# EAGLE design INSIDER01 (EAGLE 5.02)
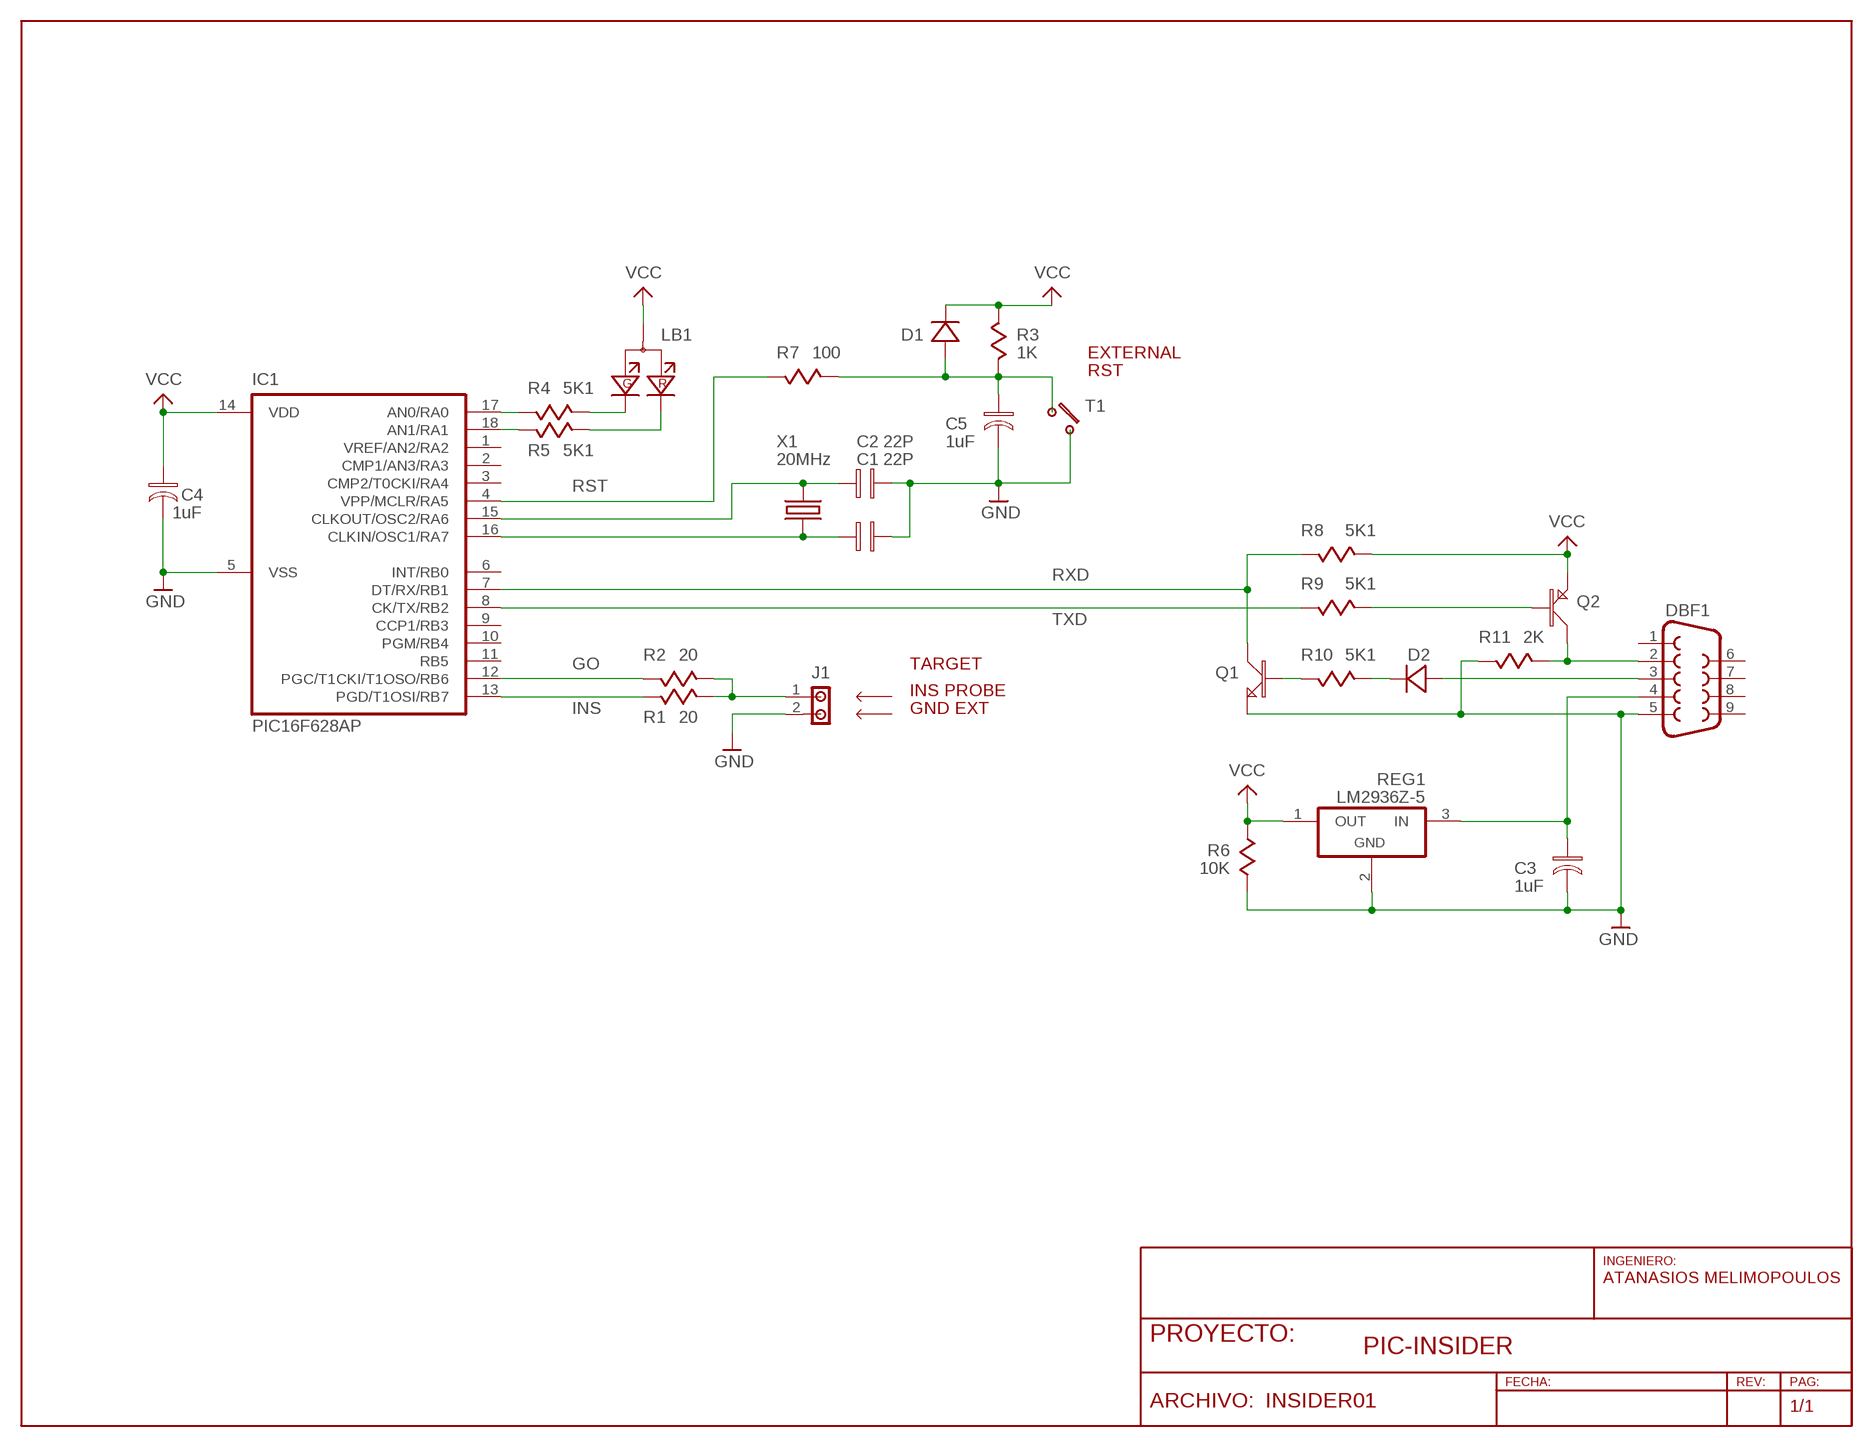
[diagram p0: schematic, sheet 1]

## Parts
C1  22P  CAP02  [C02]
C2  22P  CAP02  [C02]
C3  1uF  CAPE01  [CP01]
C4  1uF  CAPE01  [CP01]
C5  1uF  CAPE01  [CP01]
D1  1N4148  DIODE03  [D03]
D2  1N4148  DIODE03  [D03]
DBF1  F09D  [F09D]
IC1  PIC16F628AP  [DIL18]
J1  JMP2  [JP2]
LB1  LEDBIAC  [LEDBAC]
Q1  NPN1EBC  [TO92A]
Q2  PNP1EBC  [TO92A]
R1  20  RES03A  [R03A]
R2  20  RES03A  [R03A]
R3  1K  RES03A  [R03A]
R4  5K1  RES03A  [R03A]
R5  5K1  RES03A  [R03A]
R6  10K  RES03A  [R03A]
R7  100  RES03A  [R03A]
R8  5K1  RES03A  [R03A]
R9  5K1  RES03A  [R03A]
R10  5K1  RES03A  [R03A]
R11  2K  RES03A  [R03A]
REG1  LM2936Z-5  78XXL  [TO92A]
T1  TEC3  [TEC3L]
X1  20MHz  XTALV300  [HC49V]

## Nets
GND: C1.P$2 C2.P$2 C3.P$2 C4.P$2 C5.P$2 DBF1.5 IC1.5(VSS) J1.2 Q1.1(E) R6.P$2 R11.P$1 REG1.2(GND) T1.1
GO: IC1.12(PGC/T1CKI/T1OSO/RB6) R2.P$2
INS: IC1.13(PGD/T1OSI/RB7) R1.P$1
N$2: D2.P$1(A) DBF1.3
N$3: D2.P$2(K) R10.P$1
N$4: Q1.2(B) R10.P$2
N$8: Q2.2(B) R9.P$2
N$9: J1.1 R1.P$2 R2.P$1
N$10: C2.P$1 IC1.15(CLKOUT/OSC2/RA6) X1.1
N$11: C1.P$1 IC1.16(CLKIN/OSC1/RA7) X1.2
N$12: IC1.17(AN0/RA0) R4.P$2
N$13: C5.P$1 D1.P$1(A) R3.P$2 R7.P$1 T1.4
N$14: LB1.G(K2) R4.P$1
N$15: LB1.R(K1) R5.P$1
N$16: IC1.18(AN1/RA1) R5.P$2
N$19: DBF1.2 Q2.3(C) R11.P$2
N$20: C3.P$1 DBF1.4 REG1.3(IN)
RST: IC1.4(VPP/MCLR/RA5) R7.P$2
RXD: IC1.7(DT/RX/RB1) Q1.3(C) R8.P$1
TXD: IC1.8(CK/TX/RB2) R9.P$1
VCC: C4.P$1 D1.P$2(K) IC1.14(VDD) LB1.A Q2.1(E) R3.P$1 R6.P$1 R8.P$2 REG1.1(OUT)
Unconnected: DBF1.1 DBF1.6 DBF1.7 DBF1.8 DBF1.9 IC1.1(VREF/AN2/RA2) IC1.2(CMP1/AN3/RA3) IC1.3(CMP2/T0CKI/RA4) IC1.6(INT/RB0) IC1.9(CCP1/RB3) IC1.10(PGM/RB4) IC1.11(RB5)

## Notes on the sheet
- EXTERNAL
- RST
- TARGET
- INS PROBE
- GND EXT
- ATANASIOS MELIMOPOULOS
- PIC-INSIDER

## Library data of the parts
C1 C2 = AtaLib:CAP: Capacitor
C3-C5 = AtaLib:CAPE: Capacitor Pol. Elect.
D1 D2 = AtaLib:DIODE: DIODES
DBF1 = AtaLib:F09: D-SUB 9 FEMALE
IC1 = AtaLib:PIC16F6*: PIC 16F627 - 628 - 648 family
J1 = AtaLib:JMP2: Jumper 2xPin
LB1 = AtaLib:LEDBIAC: LED BIcolor AC 5mm
Q1 = AtaLib:NPN: TRANSISTOR NPN
Q2 = AtaLib:PNP: TRANSISTOR PNP
R1-R11 = AtaLib:RES: Resistor
REG1 = AtaLib:78XX: Positive Voltage Regulator
T1 = AtaLib:TEC: TECLAS INDIVIDUALES
X1 = AtaLib:XTALV300: Xtal Vert 300 mils

## Board
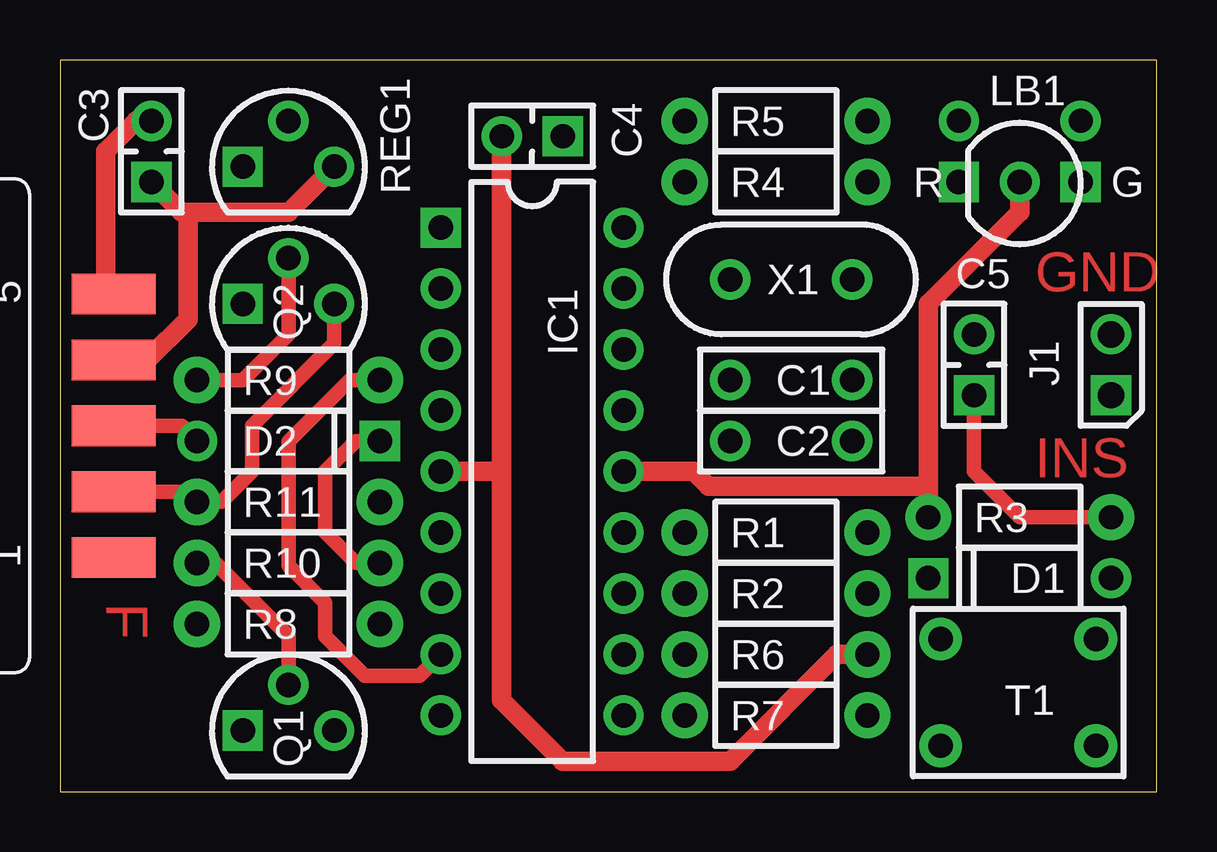
[diagram p1: board, top side]
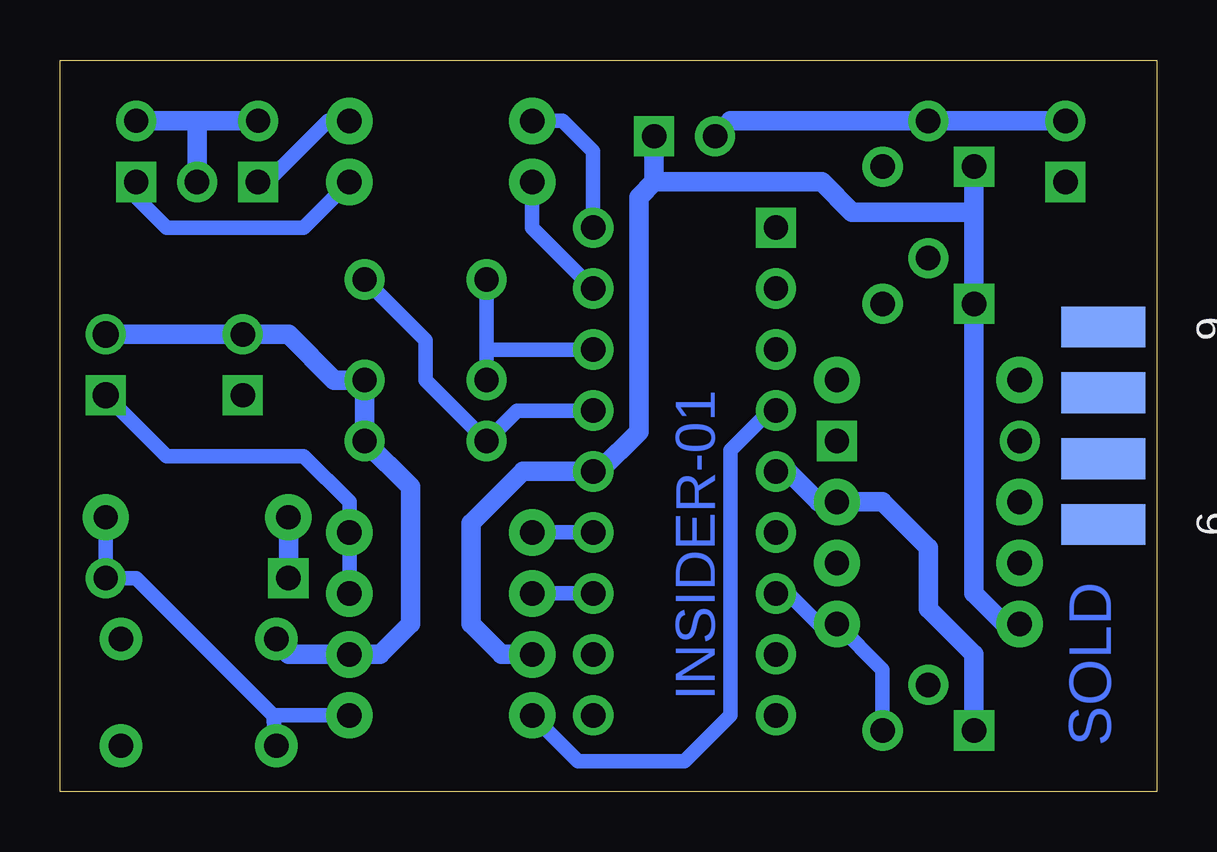
[diagram p2: board, bottom side, seen from below]

Size 45.72 x 30.48 mm. Coordinates in mm from the lower left corner, seen from the top.
Outline: 0,0 45.72,0 45.72,30.48 0,30.48 0,0
Copper layers (1*16): Top 0.035mm / dielectric 1.5mm / Bottom 0.035mm
Design rules "default": minimum track width 10mil, minimum drill 24mil, track to track 10mil, track to pad 10mil, pad to pad 10mil, via to via 10mil, smd to smd 8mil, copper to edge 25mil, drill to drill 10mil, minimum pad ring 10mil, minimum via ring 8mil, stop-mask expansion 8mil, vias tented up to drill 28mil, thermal gap 10mil

### Footprints (pad centres in the part's own frame; a part is rotated, then mirrored left to right if it is on the bottom)
C02 = drill 1.016 pad 1.676 round: P$1 -2.54,0; P$2 2.54,0
CP01 = drill 1.016 pad 1.676 square: P$1 -1.27,0 | drill 1.016 pad 1.676 round: P$2 1.27,0
D03 = drill 1.016 pad 1.676 round: P$1 -3.81,0 | drill 1.016 pad 1.676 square: P$2 3.81,0
F09D = smd 1.7 x 3.5: 1 -5.486,-6.045; 2 -2.743,-6.045; 3 0,-6.045; 4 2.743,-6.045; 5 5.486,-6.045 | smd 1.7 x 3.5 bottom: 6 -4.115,-6.045; 7 -1.372,-6.045; 8 1.372,-6.045; 9 4.115,-6.045
DIL18 = drill 1.016 pad 1.676 square: 1 -10.16,-3.81 | drill 1.016 pad 1.676 round: 2 -7.62,-3.81; 3 -5.08,-3.81; 4 -2.54,-3.81; 5 0,-3.81; 6 2.54,-3.81; 7 5.08,-3.81; 8 7.62,-3.81; 9 10.16,-3.81; 10 10.16,3.81; 11 7.62,3.81; 12 5.08,3.81; 13 2.54,3.81; 14 0,3.81; 15 -2.54,3.81; 16 -5.08,3.81; 17 -7.62,3.81; 18 -10.16,3.81
JP2 = drill 1.1 pad 1.676 square: 1 0,1.27 | drill 1.1 pad 1.676 round: 2 0,-1.27
LEDBAC = drill 1.016 pad 1.676 round: A 0,0 | drill 1.016 pad 1.676 square: G 2.54,0; R -2.54,0
TO92A = drill 1.016 pad 1.676 square: 1 -1.27,0 | drill 1.016 pad 1.676 round: 2 0.635,1.905; 3 2.54,0
R03A = drill 1.016 pad 1.93 round: P$1 -3.81,0; P$2 3.81,0
TEC3L = drill 1.016 pad 1.778 round: 1 -2.667,2.54; 2 3.81,2.54; 3 3.81,-1.905; 4 -2.667,-1.905
HC49V = drill 1.016 pad 1.676 round: 1 -2.54,0; 2 2.54,0

### Placement (x,y rotation side)
C1  30.48,17.14 0 top
C2  30.48,14.61 0 top
C3  3.81,26.67 90 top
C4  19.68,27.3 180 top
C5  38.1,17.78 90 top
D1  40.01,8.89 180 top
D2  9.53,14.61 0 top
DBF1  -3.81,15.24 90 top
IC1  19.68,13.34 270 top
J1  43.81,17.78 180 top
LB1  40.01,25.4 0 top
Q1  8.89,2.54 0 top
Q2  8.89,20.32 0 top
R1  29.84,10.79 0 top
R2  29.84,8.26 180 top
R3  40.01,11.43 0 top
R4  29.84,25.4 180 top
R5  29.84,27.94 180 top
R6  29.84,5.71 0 top
R7  29.84,3.17 180 top
R8  9.53,6.99 180 top
R9  9.53,17.14 180 top
R10  9.53,9.53 180 top
R11  9.53,12.06 180 top
REG1  8.89,26.04 0 top
T1  39.37,3.81 0 top
X1  30.48,21.34 180 top

### Tracks (layer width: path | path; a pad name or v marks a point on that pad's centre or on a via)
GND
  Top 0.813: 18.41,13.34 C4.P$2 | 18.41,13.34 18.41,3.81 20.95,1.27 27.94,1.27 32.38,5.71 R6.P$2 | IC1.5 18.41,13.34 | DBF1.5 2.13,20.73 1.91,20.95 1.91,26.67 3.17,27.94 C3.P$2
  Bottom 0.813: Q1.1 7.62,5.71 9.53,7.62 9.53,10.16 11.43,12.06 R11.P$1 14.1,12.06 15.37,13.34 IC1.5 | C4.P$2 17.78,27.94 REG1.2 C3.P$2 | T1.1 36.2,5.71 R6.P$2 32.38,5.71 31.11,6.99 31.11,12.7 C2.P$2 C1.P$2 34.29,17.14 36.2,19.05 C5.P$2 J1.2
GO
  Bottom 0.61: IC1.12 R2.P$2
INS
  Bottom 0.61: IC1.13 R1.P$1
N$2
  Top 0.61: DBF1.3 5.08,15.24 D2.P$1
N$3
  Top 0.61: R10.P$1 12.32,9.53 11.05,10.79 11.05,13.34 12.32,14.61 D2.P$2
N$4
  Top 0.61: Q1.2 9.53,6.48 6.48,9.53 R10.P$2
N$8
  Top 0.61: R9.P$2 7.62,17.14 9.53,19.05 Q2.2
N$9
  Bottom 0.61: J1.1 41.27,13.97 35.56,13.97 33.66,12.06 R1.P$2 R2.P$1
N$10
  Bottom 0.61: IC1.15 26.67,15.88 C2.P$1 30.48,17.14 30.48,18.8 X1.1
N$11
  Bottom 0.61: 27.94,18.41 C1.P$1 | 27.94,18.41 X1.2 | IC1.16 27.94,18.41
N$12
  Bottom 0.61: IC1.17 26.04,23.5 R4.P$2
N$13
  Top 0.61: C5.P$1 38.1,13.34 40.01,11.43 R3.P$2
  Bottom 0.61: R3.P$2 D1.P$1 42.55,8.89 36.83,3.17 | 36.83,3.17 R7.P$1 | T1.4 36.83,3.17
N$14
  Bottom 0.61: R4.P$1 35.56,23.5 41.27,23.5 42.55,24.77 LB1.G
N$15
  Bottom 0.61: R5.P$1 34.54,27.94 37.08,25.4 LB1.R
N$16
  Bottom 0.61: IC1.18 23.5,26.67 24.77,27.94 R5.P$2
N$17  (via drill 1 pad 1.68)
  Bottom 0.813: v37.47,27.94 v42.55,27.94
N$19
  Top 0.61: Q2.3 11.43,18.67 8,15.24 8,13.34 6.73,12.06 R11.P$2 5.28,12.5 DBF1.2
N$20
  Top 0.813: DBF1.4 3.63,17.98 5.33,19.68 5.33,24.13 | 5.33,24.13 9.53,24.13 REG1.3 | 5.33,24.13 5.08,24.13 C3.P$1
RST
  Bottom 0.61: IC1.4 16.13,15.88 17.78,14.22 17.78,3.17 19.68,1.27 24.13,1.27 R7.P$2
RXD
  Bottom 0.61: Q1.3 11.43,5.08 R8.P$1 14.1,6.99 15.37,8.26 IC1.7
TXD
  Top 0.61: IC1.8 14.99,4.83 12.7,4.83 11.05,6.48 11.05,7.87 9.53,9.4 9.53,14.61 12.06,17.14 R9.P$1
VCC
  Top 0.813: 36.2,12.73 R3.P$1 | 36.2,12.73 36.2,20.32 40.01,24.13 LB1.A | 36.2,12.73 27.02,12.73 26.42,13.34 IC1.14
  Bottom 0.813: LB1.A 40.01,27.94 | 7.62,24.13 Q2.1 7.62,8.26 6.35,6.99 R8.P$2 | 7.62,24.13 REG1.1 | 20.95,25.4 13.97,25.4 12.7,24.13 7.62,24.13 | 20.95,25.4 C4.P$1 | 20.95,25.4 21.59,24.77 21.59,14.99 23.24,13.34 IC1.14 26.42,13.34 28.57,11.18 28.57,6.99 27.3,5.71 R6.P$1 | R3.P$1 D1.P$2

### Text on the board
Top: GND | INS | F
Bottom: INSIDER-01 | SOLD